# Altium project OTP.PrjPCB
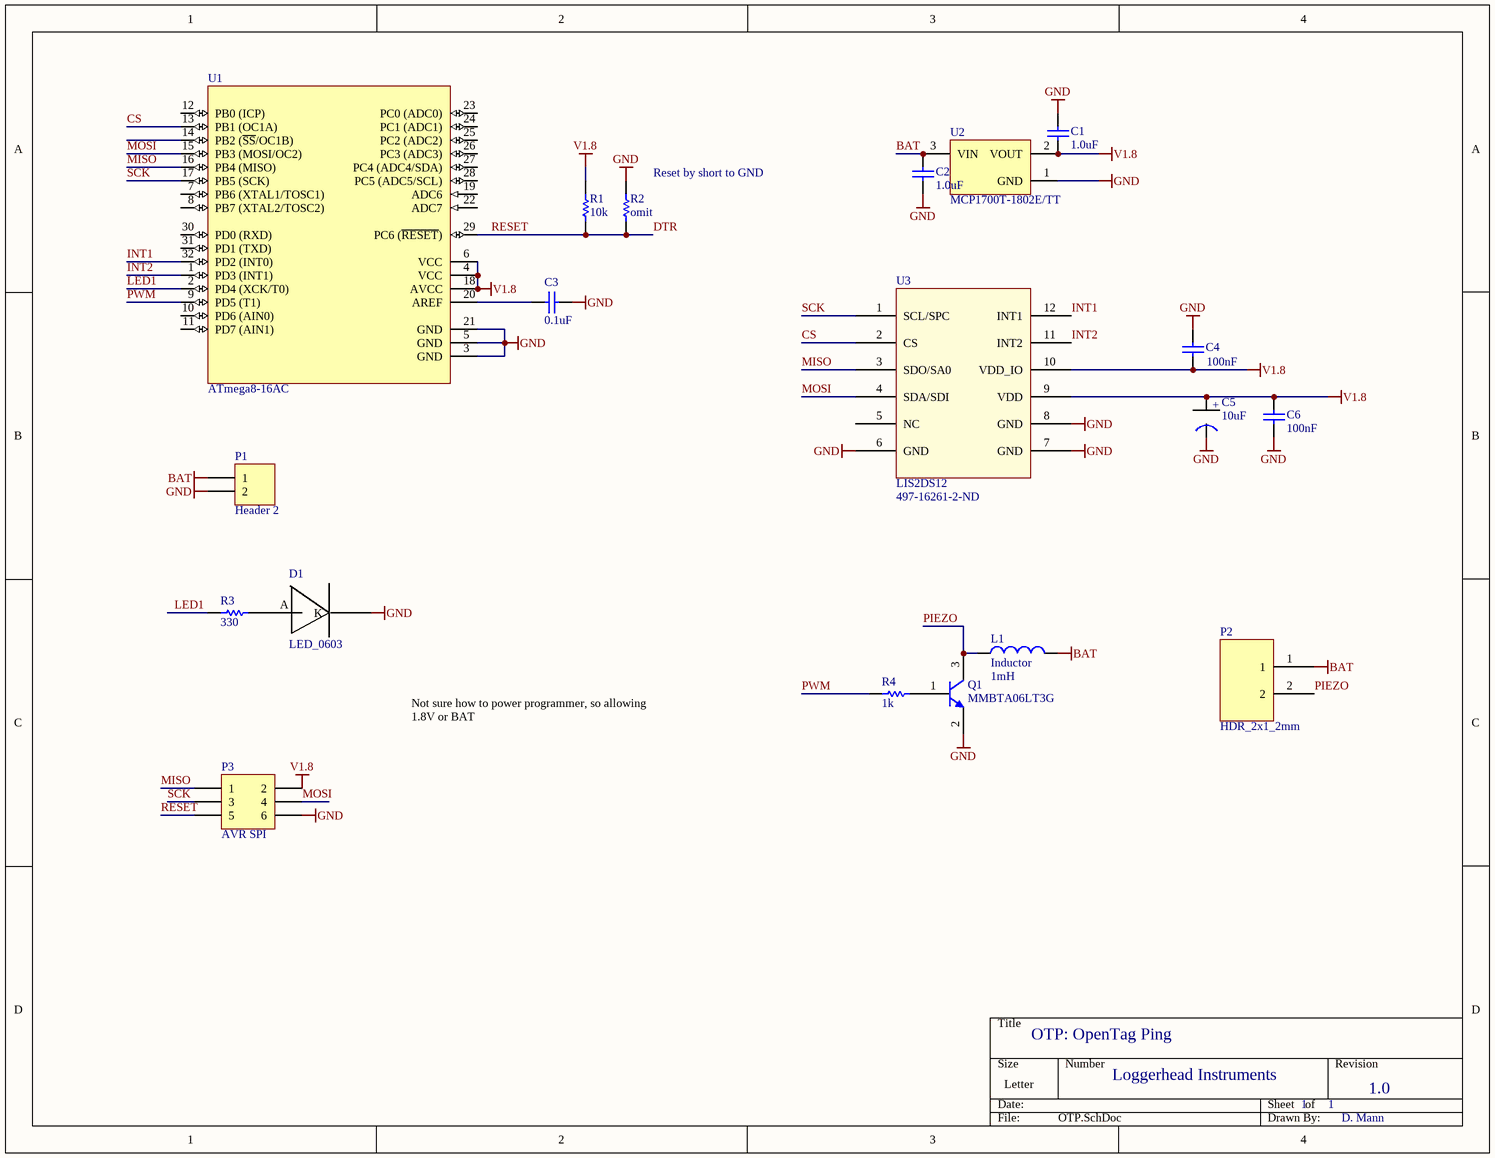
[diagram p0: OTP.SchDoc]
1 sheet, 19 parts. Net scope: global (net labels, ports and power ports of the same name join across sheets).
Board file: OTP.PcbDoc

## Sheet OTP.SchDoc
size Letter

### Parts
C1  1.0uF  [0402]
C2  1.0uF  [0402]
C3  0.1uF  [0402]
C4  100nF  [0402]
C5  10uF  [Tant0805]
C6  100nF  [0402]
D1  LED_0603  [Diode0603]
L1  Inductor  value 1mH  [INDC3216]
P1  Header 2  [HDR1X2]
P2  HDR_2x1_2mm  [HDR_2x1_2mm]
P3  AVR SPI  [HDR2X3]
Q1  MMBTA06LT3G  [ONSC-SOT-23-3-318-08_V]
R1  10k  [3-0603]
R2  omit  [3-0603]
R3  330  [3-0603]
R4  1k  [3-0603]
U1  ATmega8-16AC  [32M1-A_M]
U2  MCP1700T-1802E/TT  [SOT-23-TT3_N]
U3  LIS2DS12  Supplier Part Number 1: 497-16261-2-ND  [LGA-12]

### Nets
BAT: C2.1 L1.2 P1.1 P2.1 U2.3(VIN)
GND: C1.2 C2.2 C3.2 C4.2 C5.1(GND) C6.2 D1.K P1.2 P3.6 Q1.2(E) R2.2 U1.3(GND) U1.5(GND) U1.21(GND) U2.1(GND) U3.6(GND) U3.7(GND) U3.8(GND)
V1.8: C1.1 C4.1 C5.2(+) C6.1 P3.2 R1.2 U1.4(VCC) U1.6(VCC) U1.18(AVCC) U2.2(VOUT) U3.9(VDD) U3.10(VDD_IO)
CS: U1.13(PB1_(OC1A)) U3.2(CS)
DTR: P3.5 R1.1 R2.1 U1.29(PC6_(~{RESET}))  [also labelled RESET]
INT1: U1.32(PD2_(INT0)) U3.12(INT1)
INT2: U1.1(PD3_(INT1)) U3.11(INT2)
LED1: R3.1 U1.2(PD4_(XCK/T0))
MISO: P3.1 U1.16(PB4_(MISO)) U3.3(SDO/SA0)
MOSI: P3.4 U1.15(PB3_(MOSI/OC2)) U3.4(SDA/SDI)
PIEZO: L1.1 P2.2 Q1.3(C)
PWM: R4.1 U1.9(PD5_(T1))
SCK: P3.3 U1.17(PB5_(SCK)) U3.1(SCL/SPC)
NetC3_1: C3.1 U1.20(AREF)
NetD1_A: D1.A R3.2
NetQ1_1: Q1.1(B) R4.2

Not connected (* = marked no-connect by the designer): U1 7(PB6_(XTAL1/TOSC1)) 8(PB7_(XTAL2/TOSC2)) 10(PD6_(AIN0)) 11(PD7_(AIN1)) 12(PB0_(ICP)) 14(PB2_(~{SS}/OC1B)) 19(ADC6) 22(ADC7) 23(PC0_(ADC0)) 24(PC1_(ADC1)) 25(PC2_(ADC2)) 26(PC3_(ADC3)) 27(PC4_(ADC4/SDA)) 28(PC5_(ADC5/SCL)) 30(PD0_(RXD)) 31(PD1_(TXD)); U3 5(NC)

### Notes on the sheet
- (near R2) Reset by short to GND
- Not sure how to power programmer, so allowing 1.8V or BAT
- OTP: OpenTag Ping
- Loggerhead Instruments
- 1
- 1.0
- D. Mann

### Library data of the parts
C1 C2 = C0402: Ceramic Chip Capacitor - Standard; Note: Footprint corresponds to dimensions for bulk cassette packaging. This case size has tightened tolerances.; Value: 0.1uF; Published: 17-Jul-2002; LatestRevisionDate: 19-Mar-2004; LatestRevisionNote: Silkscreen size reduced.; DatasheetDocument: Mar-2001; PackageDocument: Mar-2001; PackageReference: 0402; Publisher: Altium Limited; Code_JEITA: 0402; Code_IPC: 1005 [0402]; ComponentLink1Description: Manufacturer Link; ComponentLink1URL: http://www.kemet.com/; ComponentLink2Description: Datasheet; ComponentLink2URL: http://www.kemet.com/kemet/web/homepage/kechome.nsf/vapubfilesname/F3102TA.pdf/$file/F3102TA.pdf
C3 = C0402: Ceramic Chip Capacitor - Standard; Note: Footprint corresponds to dimensions for bulk cassette packaging. This case size has tightened tolerances.; Published: 17-Jul-2002; LatestRevisionDate: 19-Mar-2004; LatestRevisionNote: Silkscreen size reduced.; DatasheetDocument: Mar-2001; PackageDocument: Mar-2001; PackageReference: 0402; Publisher: Altium Limited; Code_JEITA: 0402; Code_IPC: 1005 [0402]; ComponentLink1Description: Manufacturer Link; ComponentLink1URL: http://www.kemet.com/; ComponentLink2Description: Datasheet; ComponentLink2URL: http://www.kemet.com/kemet/web/homepage/kechome.nsf/vapubfilesname/F3102TA.pdf/$file/F3102TA.pdf; Value: 0.1uF
C4 C6 = C0402: Ceramic Chip Capacitor - Standard; Note: Footprint corresponds to dimensions for bulk cassette packaging. This case size has tightened tolerances.; Value: 100pF; Published: 17-Jul-2002; LatestRevisionDate: 19-Mar-2004; LatestRevisionNote: Silkscreen size reduced.; DatasheetDocument: Mar-2001; PackageDocument: Mar-2001; PackageReference: 0402; Publisher: Altium Limited; Code_JEITA: 0402; Code_IPC: 1005 [0402]; ComponentLink1Description: Manufacturer Link; ComponentLink1URL: http://www.kemet.com/; ComponentLink2Description: Datasheet; ComponentLink2URL: http://www.kemet.com/kemet/web/homepage/kechome.nsf/vapubfilesname/F3102TA.pdf/$file/F3102TA.pdf
C5 = Tant0805: Value: 10uF
L1 = Inductor: Code_IEC: 1005; Published: 8-Jun-2000; LatestRevisionDate: 29-May-2009; LatestRevisionNote: IPC-7351 Footprint Added.; PackageReference: 0402-A; Publisher: Altium Limited; PackageDescription: Chip Inductor; Code_JEITA: 0402
P1 = Header 2: Header, 2-Pin; LatestRevisionDate: 17-Jul-2002; LatestRevisionNote: Re-released for DXP Platform.; Publisher: Altium Limited
P3 = Header 3X2: Header, 3-Pin, Dual row; LatestRevisionDate: 17-Jul-2002; LatestRevisionNote: Re-released for DXP Platform.; Publisher: Altium Limited
Q1 = MMBTA06LT3G: Driver Transistor, NPN Silicon, 3-Pin SOT-23, Pb-Free, Tape and Reel; Manufacturer: On Semiconductor; fT Min (MHz): 100; IC Continuous (A): 0.5; DatasheetVersion: Rev. 8; PackageVersion: Rev. AP, 11/2009; PackageReference: SOT-23-3-318-08; PackageDescription: 3-Pin Small Outline Transistor, Body 2.92 x 1.3 mm, Pitch 0.95 mm; Supplier 1: Digi-Key; Supplier Part Number 1: MMBTA06LT3GOSTR-ND; Supplier 2: Digi-Key; Supplier Part Number 2: MMBTA06LT3GOSCT-ND; Supplier 3: Digi-Key; Supplier Part Number 3: MMBTA06LT3GOSDKR-ND; Supplier 4: Farnell; Supplier Part Number 4: 2101815; Supplier 5: Newark; Supplier Part Number 5: 42K1333; Supplier 6: Newark; Supplier Part Number 6: 06R3470; Supplier 7: Mouser; Supplier Part Number 7: 863-MMBTA06LT3G; Packing: Tape and Reel; Polarity: NPN; RoHS: TRUE; Mounting Technology: Surface Mount; PartNumber: MMBTA06LT3G; ComponentLink1Description: Manufacturer URL; ComponentLink1URL: http://www.onsemi.com/; ComponentLink2Description: Datasheet; ComponentLink2URL: http://www.onsemi.cn/pub_link/Collateral/MMBTA05LT1-D.PDF; ComponentLink3Description: Package Specification; ComponentLink3URL: http://www.onsemi.cn/pub_link/Collateral/318-08.PDF
R1-R4 = ERJ3RK: Precision Thick Film Chip Resistor, 10 Ohm to 1M Ohm Range, 1% and 0.5% Tolerance, 0603 Size, 0.063 W; Published: 17-Dec-2003; LatestRevisionDate: 19-Mar-2004; LatestRevisionNote: Silkscreen size reduced.; PackageDocument: Mar-2003; PackageReference: 3-0603; Publisher: Altium Limited; Code_IPC: 1608 [0603]; ComponentLink1Description: Manufacturer Link; ComponentLink1URL: http://www.panasonic.com/industrial/components/resistive_products.htm; ComponentLink2Description: Datasheet; ComponentLink2URL: http://www.panasonic.com/industrial/components/pdf/AOA0000CE2.pdf
U1 = ATmega8-16AC: 8-Bit AVR Microcontroller with 8K Bytes of In-System Programmable Flash Memory; Published: 17-Sep-2003; LatestRevisionDate: 13-Apr-2006; LatestRevisionNote: IPC-7351 Footprint Added.; DatasheetVersion: 2486H-AVR-09/02; PackageVersion: revB, Oct-2001; PackageReference: 32A; Publisher: Altium Limited; PackageDescription: 32-Pin Thin Quad Flat Pack 0.8 mm Pitch; Code_JEDEC: MS-026-ABA; ComponentLink1Description: Manufacturer Link; ComponentLink1URL: http://www.atmel.com; ComponentLink2Description: Datasheet; ComponentLink2URL: http://www.atmel.com/dyn/resources/prod_documents/doc2486.pdf
U2 = MCP1700T-1802E/TT: Low Quiescent Current LDO, 3-Pin SOT-23, Extended Temperature, Tape and Reel; Manufacturer: Microchip; DatasheetVersion: revB, Feb-2007; PackageVersion: revBB, Aug-2009; PackageReference: SOT-23-TT3; PackageDescription: 3-Lead Plastic Small Outline Transistor (TT) [SOT-23]; Supplier 1: Digi-Key; Supplier Part Number 1: MCP1700T1802ETTTR-ND; Supplier 2: Digi-Key; Supplier Part Number 2: MCP1700T1802ETTCT-ND; Supplier 3: Digi-Key; Supplier Part Number 3: MCP1700T1802ETTDKR-ND; Supplier 4: Farnell; Supplier Part Number 4: 1296591RL; Supplier 5: Farnell; Supplier Part Number 5: 1296591; Supplier 6: Newark; Supplier Part Number 6: 84R5175; Supplier 7: Mouser; Supplier Part Number 7: 579-MCP1700T1802E/TT; Mounting Technology: Surface Mount; Code_IPC: SOT23-3; PartNumber: MCP1700T-1802E/TT; ComponentLink1Description: Manufacturer URL; ComponentLink1URL: http://www.microchip.com/; ComponentLink2Description: Datasheet; ComponentLink2URL: http://ww1.microchip.com/downloads/en/DeviceDoc/21826b.pdf; ComponentLink3Description: Package Specification; ComponentLink3URL: http://www.microchip.com/stellent/groups/techpub_sg/documents/packagingspec/en012702.pdf
U3 = LIS2DS12: Supplier 1: Digi-Key